# EAGLE design Houston Board v1.1 (EAGLE 9.6.1)
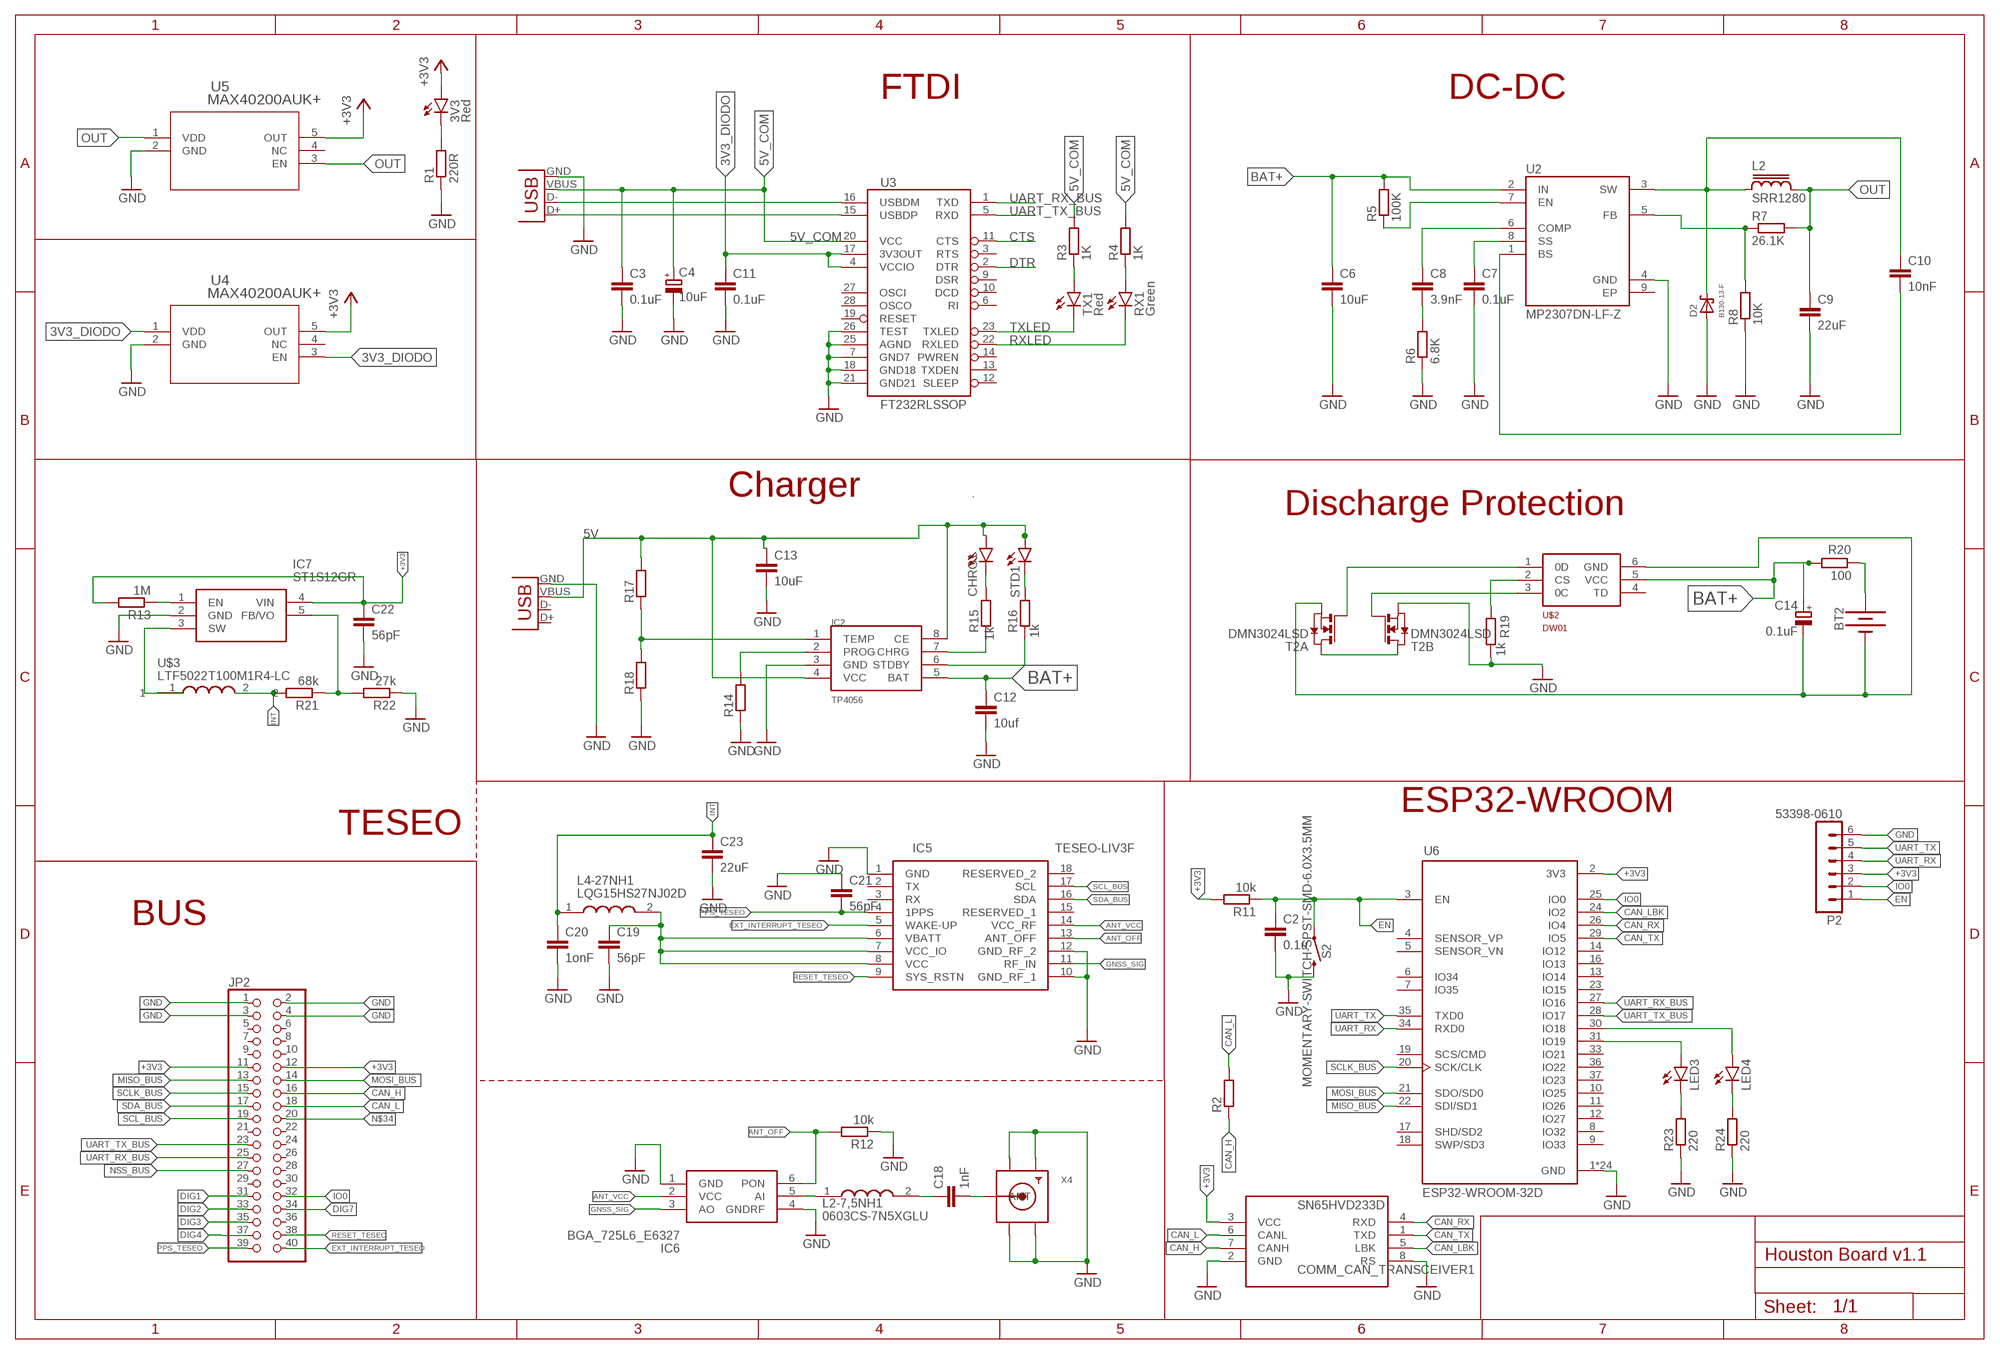
[diagram p0: schematic, sheet 1]

## Parts
3V3  Red  LEDCHIPLED_0805  [CHIPLED_0805]
BT2  BATTERY-18650  [BATTERY_18650-HOLDER]
C2  0.1u  C-EUC1206  [C1206]
C3  0.1uF  C-EUC0805  [C0805]
C4  10uF  CPOL-EUB  [PANASONIC_B]
C6  10uF  C-EUC0805  [C0805]
C7  0.1uF  C-EUC0805  [C0805]
C8  3.9nF  C-EUC0805  [C0805]
C9  22uF  C-EUC0805  [C0805]
C10  10nF  C-EUC0805  [C0805]
C11  0.1uF  C-EUC0805  [C0805]
C12  10uf  C-EUC0805  [C0805]
C13  10uF  C-EUC0805  [C0805]
C14  0.1uF  CPOL-EUC  [PANASONIC_C]
C18  1nF  C-EUC1206  [C1206]
C19  56pF  C-EUC1206  [C1206]
C20  1onF  C-EUC1206  [C1206]
C21  56pF  C-EUC1206  [C1206]
C22  56pF  C-EUC1206  [C1206]
C23  22uF  C-EUC1206  [C1206]
CHRG1  LEDCHIP-LED0805  [CHIP-LED0805]
COMM_CAN_TRANSCEIVER1  SN65HVD233D  [SOIC8]
D2  B130-13-F  [SMA]
IC2  TP4056  [SOP-8]
IC5  TESEO-LIV3F  [SON110P970X1010X230-18N]
IC6  BGA_725L6_E6327  [BGA725L6E6327]
IC7  ST1S12GR  [SOT95P280X110-5N]
JP2  PINHD-2X20  [2X20]
L2  SRR1280  [SRR1280]
L2-7,5NH1  0603CS-7N5XGLU  [0603CS82NXGLW]
L4-27NH1  LQG15HS27NJ02D  [LQG15WH0N7B02D]
LED3  LEDCHIPLED_0805  [CHIPLED_0805]
LED4  LEDCHIPLED_0805  [CHIPLED_0805]
P2  53398-0610  [53398-0610]
R1  220R  R-EU_R0805  [R0805]
R2  R-EU_R0805  [R0805]
R3  1K  R-EU_R0805  [R0805]
R4  1K  R-EU_R0805  [R0805]
R5  100K  R-EU_R0805  [R0805]
R6  6.8K  R-EU_R0805  [R0805]
R7  26.1K  R-EU_R0805  [R0805]
R8  10K  R-EU_R0805  [R0805]
R11  10k  R-EU_R1206  [R1206]
R12  10k  R-EU_M1206  [M1206]
R13  1M  R-EU_M1206  [M1206]
R14  R-EU_R0805  [R0805]
R15  1k  R-EU_R0805  [R0805]
R16  1k  R-EU_R0805  [R0805]
R17  R-EU_R0805  [R0805]
R18  R-EU_R0805  [R0805]
R19  1k  R-EU_R0805  [R0805]
R20  100  R-EU_R0805  [R0805]
R21  68k  R-EU_M1206  [M1206]
R22  27k  R-EU_M1206  [M1206]
R23  220  R-EU_R1206  [R1206]
R24  220  R-EU_R1206  [R1206]
RX1  Green  LEDCHIPLED_0805  [CHIPLED_0805]
S2  MOMENTARY-SWITCH-SPST-SMD-6.0X3.5MM  [TACTILE_SWITCH_SMD_6.0X3.5MM]
STD1  LEDCHIP-LED0805  [CHIP-LED0805]
T2  DMN3024LSD  [TSSOP-8]
TX1  Red  LEDCHIPLED_0805  [CHIPLED_0805]
U2  MP2307DN-LF-Z  [SOIC127P600X170-9N]
U3  FT232RLSSOP  [SSOP28DB]
U4  MAX40200AUK+  [21-0057F_MXM]
U5  MAX40200AUK+  [21-0057F_MXM]
U6  ESP32-WROOM-32D  [MODULE_ESP32-WROOM-32D]
U$2  DW01  [SOT23-6]
U$3  LTF5022T100M1R4-LC  [LTF5022T]
X1  USB-SMD-NS  [USB-MINIB-NOSTOP]
X2  USB-SMD-NS  [USB-MINIB-NOSTOP]
X4  SMACONNECTOR  [SMA90_DIP]

## Nets
3V3_DIODO: C11.1 U3.4(VCCIO) U3.17(3V3OUT) U4.1(VDD) U4.3(EN)
5V: C13.1 CHRG1.A IC2.4(VCC) IC2.8(CE) R17.2 STD1.A X2.VBUS
5V_COM: C3.1 C4.+ R3.2 R4.2 U3.20(VCC) X1.VBUS
+3V3: 3V3.A C22.1 COMM_CAN_TRANSCEIVER1.3(VCC) IC7.4(VIN) JP2.11 JP2.12 P2.3 R11.2 R13.2 U4.5(OUT) U5.5(OUT) U6.2(3V3)
ANT_OFF: IC5.13(ANT_OFF) IC6.6(PON) R12.2
ANT_VCC: IC5.14(VCC_RF) IC6.2(VCC)
BAT+: C6.1 C12.1 C14.+ IC2.5(BAT) R5.2 R20.1 U2.2(IN) U$2.5(VCC)
CAN_H: COMM_CAN_TRANSCEIVER1.7(CANH) JP2.16 R2.1
CAN_L: COMM_CAN_TRANSCEIVER1.6(CANL) JP2.18 R2.2
CAN_LBK: COMM_CAN_TRANSCEIVER1.5(LBK) U6.24(IO2)
CAN_RX: COMM_CAN_TRANSCEIVER1.4(RXD) U6.26(IO4)
CAN_TX: COMM_CAN_TRANSCEIVER1.1(TXD) U6.29(IO5)
CTS: U3.11(CTS)
DTR: U3.2(DTR)
EN: C2.1 P2.1 R11.1 S2.1 U6.3(EN)
EXT_INTERRUPT_TESEO: IC5.5(WAKE-UP) JP2.40
GND: C2.2 C3.2 C4.- C6.2 C7.2 C9.2 C11.2 C12.2 C13.2 C19.2 C20.2 C21.1 C22.2 C23.2 COMM_CAN_TRANSCEIVER1.2(GND) COMM_CAN_TRANSCEIVER1.8(RS) D2.A IC2.3(GND) IC5.1(GND) IC5.10(GND_RF_1) IC5.12(GND_RF_2) IC6.1(GND) IC6.4(GNDRF) IC7.2(GND) JP2.1 JP2.2 JP2.3 JP2.4 P2.6 R1.1 R6.1 R8.1 R12.1 R14.1 R18.1 R19.1 R22.1 R23.1 R24.1 S2.2 T2.6(B:S) T2.7(B:S) U2.4(GND) U3.7(GND7) U3.18(GND18) U3.21(GND21) U3.25(AGND) U3.26(TEST) U4.2(GND) U5.2(GND) U6.1(GND) U6.15(GND) U6.38(GND) U6.39_1(GND) U6.39_2(GND) U6.39_3(GND) U6.39_4(GND) U6.39_5(GND) U6.39_6(GND) U6.39_7(GND) U6.39_8(GND) U6.39_9(GND) U6.39_10(GND) U6.39_11(GND) U6.39_12(GND) U6.39_13(GND) U6.39_14(GND) U6.39_15(GND) U6.39_16(GND) U6.39_17(GND) U6.39_18(GND) U6.39_19(GND) U6.39_20(GND) U6.39_21(GND) X1.GND X2.GND X4.GND1 X4.GND2 X4.GND3 X4.GND4
GNSS_SIG: IC5.11(RF_IN) IC6.3(AO)
INT: C20.1 C23.1 L4-27NH1.1 R21.2 U$3.2
IO0: P2.2 U6.25(IO0)
MISO_BUS: JP2.13 U6.22(SDI/SD1)
MOSI_BUS: JP2.14 U6.21(SDO/SD0)
N$3: JP2.37
N$4: JP2.34
N$7: JP2.32
N$8: R5.1 U2.7(EN)
N$9: C8.2 R6.2
N$10: C7.1 U2.8(SS)
N$11: C8.1 U2.6(COMP)
N$12: C10.1 D2.C L2.1 U2.3(SW)
N$13: R7.1 R8.2 U2.5(FB)
N$14: C10.2 U2.1(BS)
N$16: JP2.35
N$17: JP2.33
N$18: JP2.31
N$19: R3.1 TX1.A
N$20: R4.1 RX1.A
N$21: 3V3.C R1.2
N$22: LED3.C R23.2
N$23: LED4.C R24.2
N$24: LED4.A U6.30(IO18)
N$25: LED3.A U6.31(IO19)
N$28: C19.1 IC5.6(VBATT) IC5.7(VCC_IO) IC5.8(VCC) L4-27NH1.2
N$29: C18.2 X4.ANTENNA(ANT)
N$30: IC6.5(AI) L2-7,5NH1.1
N$31: IC2.2(PROG) R14.2
N$32: IC2.7(CHRG) R15.1
N$33: IC2.6(STDBY) R16.1
N$34: JP2.20
N$35: CHRG1.C R15.2
N$36: R16.2 STD1.C
N$37: IC2.1(TEMP) R17.1 R18.2
N$38: R19.2 U$2.2(CS)
N$39: BT2.PWR@1(+) R20.2
N$40: BT2.GND@1(-) C14.- T2.2(A:S) T2.3(A:S) U$2.6(GND)
N$41: T2.1(A:D) T2.8(B:D)
N$42: T2.4(A:G) U$2.1(0D)
N$43: T2.5(B:G) U$2.3(0C)
N$44: C18.1 L2-7,5NH1.2
N$45: IC7.1(EN) R13.1
N$46: IC7.3(SW) U$3.1
N$47: IC7.5(FB/VO) R21.1 R22.2
NSS_BUS: JP2.27
OUT: C9.1 L2.2 R7.2 U5.1(VDD) U5.3(EN)
PPS_TESEO: C21.2 IC5.4(1PPS) JP2.39
RESET_TESEO: IC5.9(SYS_RSTN) JP2.38
RXLED: RX1.C U3.22(RXLED)
SCL_BUS: IC5.17(SCL) JP2.19
SCLK_BUS: JP2.15 U6.20(SCK/CLK)
SDA_BUS: IC5.16(SDA) JP2.17
TXLED: TX1.C U3.23(TXLED)
UART_RX: P2.4 U6.34(RXD0)
UART_RX_BUS: JP2.25 U3.1(TXD) U6.27(IO16)
UART_TX: P2.5 U6.35(TXD0)
UART_TX_BUS: JP2.23 U3.5(RXD) U6.28(IO17)
USB_D+1: U3.15(USBDP) X1.D+
USB_D-1: U3.16(USBDM) X1.D-
Unconnected: IC5.2(TX) IC5.3(RX) IC5.15(RESERVED_1) IC5.18(RESERVED_2) JP2.5 JP2.6 JP2.7 JP2.8 JP2.9 JP2.10 JP2.21 JP2.22 JP2.24 JP2.26 JP2.28 JP2.29 JP2.30 JP2.36 U3.3(RTS) U3.6(RI) U3.9(DSR) U3.10(DCD) U3.12(SLEEP) U3.13(TXDEN) U3.14(PWREN) U3.19(RESET) U3.27(OSCI) U3.28(OSCO) U4.4(NC) U5.4(NC) U6.4(SENSOR_VP) U6.5(SENSOR_VN) U6.6(IO34) U6.7(IO35) U6.8(IO32) U6.9(IO33) U6.10(IO25) U6.11(IO26) U6.12(IO27) U6.13(IO14) U6.14(IO12) U6.16(IO13) U6.17(SHD/SD2) U6.18(SWP/SD3) U6.19(SCS/CMD) U6.23(IO15) U6.33(IO21) U6.36(IO22) U6.37(IO23) U$2.4(TD) X2.D+ X2.D-

## Notes on the sheet
- FTDI | DC-DC
- Charger
- Discharge Protection
- ESP32-WROOM
- TESEO
- BUS

## Power pins joined to a net without a drawn wire
EP: U2.9(EP)

## Library data of the parts
3V3 CHRG1 LED3 LED4 RX1 STD1 TX1 = led:LED: LED OSRAM: - CHIPLED LG R971, LG N971, LY N971, LG Q971, LY Q971, LO R971, LY R971 LH N974, LH R974 LS Q976, LO Q976, LY Q976 LO Q996 - Hyper CHIPLED LW Q18S LB Q993, LB Q99A, LB R99A - SideLED LS A670, LO A670, LY A670, LG A670, LP A670 LB A673, LV A673, LT A673, LW A673 LH A674 LY A675 LS A676, LA A676, LO A676, LY A676, LW A676 LS A679, LY A679, LG A679 - Hyper Micro SIDELED® LS Y876, LA Y876, LO Y876, LY Y876 LT Y87S - SmartLED LW L88C, LW L88S LB L89C, LB L89S, LG L890 LS L89K, LO L89K, LY L89K LS L896, LA L896, LO L896, LY L896 - TOPLED LS T670, LO T670, LY T670, LG T670, LP T670 LSG T670, LSP T670, LSY T670, LOP T670, LYG T670 LG T671, LOG T671, LSG T671 LB T673, LV T673, LT T673, LW T673 LH T674 LS T676, LA T676, LO T676, LY T676, LB T676, LH T676, LSB T676, LW T676 LB T67C, LV T67C, LT T67C, LS T67K, LO T67K, LY T67K, LW E67C LS E67B, LA E67B, LO E67B, LY E67B, LB E67C, LV E67C, LT E67C LW T67C LS T679, LY T679, LG T679 LS T770, LO T770, LY T770, LG T770, LP T770 LB T773, LV T773, LT T773, LW T773 LH T774 LS E675, LA E675, LY E675, LS T675 LS T776, LA T776, LO T776, LY T776, LB T776 LHGB T686 LT T68C, LB T68C - Hyper Mini TOPLED® LB M676 - Mini TOPLED Santana® LG M470 LS M47K, LO M47K, LY M47K Source: http://www.osram.convergy.de LUXEON: - LUMILED® LXK2-PW12-R00, LXK2-PW12-S00, LXK2-PW14-U00, LXK2-PW14-V00 LXK2-PM12-R00, LXK2-PM12-S00, LXK2-PM14-U00 LXK2-PE12-Q00, LXK2-PE12-R00, LXK2-PE12-S00, LXK2-PE14-T00, LXK2-PE14-U00 LXK2-PB12-K00, LXK2-PB12-L00, LXK2-PB12-M00, LXK2-PB14-N00, LXK2-PB14-P00, LXK2-PB14-Q00 LXK2-PR12-L00, LXK2-PR12-M00, LXK2-PR14-Q00, LXK2-PR14-R00 LXK2-PD12-Q00, LXK2-PD12-R00, LXK2-PD12-S00 LXK2-PH12-R00, LXK2-PH12-S00 LXK2-PL12-P00, LXK2-PL12-Q00, LXK2-PL12-R00 Source: www.luxeon.com KINGBRIGHT: KA-3528ASYC Source: www.kingbright.com
BT2 = SparkFun-Batteries:BATTERY: Battery - Single Cell A variety of battery chemistries, sizes, and footprints. Device List: 20MM_PTH - Coin Cell Battery Holder - 20mm (PTH) <https://www.sparkfun.com/products/783> 6.8MM_PTH - Coin Cell Battery Holder - 6.8MM(SMD) <https://www.digikey.com/product-detail/en/seiko-instruments/MS621FE-FL11E/728-1057-ND/1889208?WT.srch=1&gclid=CNOQ5a6LzdQCFZS2wAodXCkE0g> 12MM_SMD - Coin Cell Battery Holder - 12mm (SMD) <https://www.sparkfun.com/products/10592> 12MM_PTH - Coin Cell Battery Holder - 12mm (PTH) <https://www.sparkfun.com/products/7948> 20MM_SMD - 20mm Coin Cell Battery Holder (SMD) (2 legs) Used on the Big Time Watch Kit <https://www.sparkfun.com/products/11734> 20MM_SMD_4LEGS - Coin Cell Battery Holder - 20mm (SMD) <https://www.sparkfun.com/products/11892> 20MM_SMD_4LEGS_OVERPASTE - Coin Cell Battery Holder - 20mm (SMD) <https://www.sparkfun.com/products/11892> (Over-paste on the legs) 24.5MM_PTH - Coin Cell Battery Holder - 24.5mm (PTH) <https://www.sparkfun.com/products/8863> 9V - 9V Battery Holder - PC Mount Used on the SparkFun SparkPunk Sound Kit <https://www.sparkfun.com/products/11177> and SparkFun SparkPunk Sequencer Kit <https://www.sparkfun.com/products/12707> 18650 - Battery Holder - 18650 (PTH) <https://www.sparkfun.com/products/13113> AA - Battery Holder - 1xAA (PTH) <https://www.sparkfun.com/products/7949> AAA - Battery Holder - 1xAAA (PTH) <https://www.sparkfun.com/products/12718> AA_KIT - Battery Holder - 1xAA (PTH) <https://www.sparkfun.com/products/7949> Special kit package - pads only have exposed copper on one side of the board. AAA_KIT - Battery Holder - 1xAAA (PTH) <https://www.sparkfun.com/products/12718> Special kit package - pads only have exposed copper on one side of the board.; PROD_ID: BATT-12327; SF_SKU: PRT-13113
C2 C3 C6-C13 C18-C23 = rcl:C-EU: CAPACITOR, European symbol; SPICEPREFIX: C
C4 C14 = rcl:CPOL-EU: POLARIZED CAPACITOR, European symbol; SPICEPREFIX: C
COMM_CAN_TRANSCEIVER1 = SN65HVD233D:SN65HVD233D; AVAILABILITY: Unavailable; DESCRIPTION: 3.3V CAN Transceiver with Standby Mode, Loop-back 8-SOIC -40 to 125; MF: Texas Instruments; MP: SN65HVD233D; PACKAGE: SOIC-8 Texas Instruments; PRICE: None
D2 = B130-13-F:B130-13-F; AVAILABILITY: Unavailable; DESCRIPTION: Diode Schottky 30V 1A Surface Mount SMA; MF: Multicomp; MP: B130-13-F; PACKAGE: DO-214 Multicomp; PRICE: None
IC2 = TP4056:TP4056
IC5 = SamacSys_Parts:TESEO-LIV3F: GPS Modules Tiny GNSS module Source: Datasheet <https://www.st.com/resource/en/datasheet/teseo-liv3f.pdf>; ARROW_PART_NUMBER: TESEO-LIV3F; ARROW_PRICE-STOCK: https://www.arrow.com/en/products/teseo-liv3f/stmicroelectronics; DESCRIPTION: GPS Modules Tiny GNSS module; HEIGHT: 2.3mm; MANUFACTURER_NAME: STMicroelectronics; MANUFACTURER_PART_NUMBER: TESEO-LIV3F; MOUSER_PART_NUMBER: 511-TESEO-LIV3F; MOUSER_PRICE-STOCK: https://www.mouser.co.uk/ProductDetail/STMicroelectronics/TESEO-LIV3F?qs=HXFqYaX1Q2wXp9tn7dEmMw%3D%3D
IC6 = SamacSys_Parts:BGA_725L6_E6327: INFINEON - BGA 725L6 E6327 - RF AMP, 20DB, 1.615GHZ, 3.6V, TSLP-6 Source: Datasheet <https://www.infineon.com/dgdl/Infineon-BGA725L6-DS-v02_00-en.pdf?fileId=db3a30433784a0400137ef9a4d341f23>; DESCRIPTION: INFINEON - BGA 725L6 E6327 - RF AMP, 20DB, 1.615GHZ, 3.6V, TSLP-6; HEIGHT: 0.4mm; MANUFACTURER_NAME: Infineon; MANUFACTURER_PART_NUMBER: BGA 725L6 E6327; MOUSER_PART_NUMBER: 726-BGA725L6E6327; MOUSER_PRICE-STOCK: https://www.mouser.co.uk/ProductDetail/Infineon-Technologies/BGA-725L6-E6327?qs=l6ZoeTYLMwPIme2fOcdDvg%3D%3D
IC7 = SamacSys_Parts:ST1S12GR: STMICROELECTRONICS - ST1S12GR - DC/DC CONV, BUCK, 1.7MHZ, TSOT-23-5 Source: Datasheet <https://www.st.com/resource/en/datasheet/st1s12xx.pdf>; ARROW_PART_NUMBER: ST1S12GR; ARROW_PRICE-STOCK: https://www.arrow.com/en/products/st1s12gr/stmicroelectronics; DESCRIPTION: STMICROELECTRONICS - ST1S12GR - DC/DC CONV, BUCK, 1.7MHZ, TSOT-23-5; HEIGHT: 1.1mm; MANUFACTURER_NAME: STMicroelectronics; MANUFACTURER_PART_NUMBER: ST1S12GR; MOUSER_PART_NUMBER: 511-ST1S12GR; MOUSER_PRICE-STOCK: https://www.mouser.co.uk/ProductDetail/STMicroelectronics/ST1S12GR?qs=QKF3unAkNR%252BifYUR85%252B%252BAA%3D%3D
JP2 = pinhead:PINHD-2X20: PIN HEADER
L2 = inductor-bourns:SRR1280: POWER INDUCTOR
L2-7,5NH1 = SamacSys_Parts:0603CS-7N5XGLU: COILCRAFT - 0603CS-7N5XGLU - High Frequency Inductor, 7.5 nH, 0603CS Series, 700 mA, 0603 [1608 Metric], Wirewound, 0.106 ohm Source: Datasheet <https://www.coilcraft.com/pdfs/0603cs.pdf>; DESCRIPTION: COILCRAFT - 0603CS-7N5XGLU - High Frequency Inductor, 7.5 nH, 0603CS Series, 700 mA, 0603 [1608 Metric], Wirewound, 0.106 ohm; HEIGHT: 1mm; MANUFACTURER_NAME: COILCRAFT; MANUFACTURER_PART_NUMBER: 0603CS-7N5XGLU
L4-27NH1 = SamacSys_Parts:LQG15HS27NJ02D: Inductor SMD 0402 27nH 300mA Murata LQG15HS Series Wire-wound SMD Inductor 27 nH +/-5% Wire-Wound 300mA Idc Q:8 Source: Datasheet <https://psearch.en.murata.com/inductor/product/LQG15HS27NJ02#.html>; DESCRIPTION: Inductor SMD 0402 27nH 300mA Murata LQG15HS Series Wire-wound SMD Inductor 27 nH +/-5% Wire-Wound 300mA Idc Q:8; HEIGHT: 0.55mm; MANUFACTURER_NAME: Murata Electronics; MANUFACTURER_PART_NUMBER: LQG15HS27NJ02D; MOUSER_PART_NUMBER: 81-LQG15HS27NJ02D; MOUSER_PRICE-STOCK: https://www.mouser.co.uk/ProductDetail/Murata-Electronics/LQG15HS27NJ02D?qs=ctz47l0uL1AbPpSO0oLF1A%3D%3D
P2 = con-molex-picoblade:53398-0610: HEADER
R1-R8 R11 R14-R20 R23 R24 = rcl:R-EU_: RESISTOR, European symbol; SPICEPREFIX: R
R12 R13 R21 R22 = rcl (2):R-EU_: RESISTOR, European symbol
S2 = SparkFun-Switches:MOMENTARY-SWITCH-SPST: Momentary Switch (Pushbutton) - SPST Normally-open (NO) SPST momentary switches (buttons, pushbuttons). Variants PTH-12MM - 12mm square, through-hole Momentary Pushbutton Switch - 12mm Square <https://www.sparkfun.com/products/9190> (COM-09190) PTH-6.0MM, PTH-6.0MM-KIT - 6.0mm square, through-hole Mini Pushbutton Switch <https://www.sparkfun.com/products/97> (COM-00097) KIT package intended for soldering kit's - only one side of pads' copper is exposed. PTH-RIGHT-ANGLE-KIT - Right-angle, through-hole Right Angle Tactile Button <https://www.sparkfun.com/products/10791> - Used on SparkFun BigTime Watch Kit <https://www.sparkfun.com/products/11734> SMD-12MM - 12mm square, surface-mount Tactile Button - SMD (12mm) <https://www.sparkfun.com/products/12993> (COM-12993) Used on SparkFun PicoBoard <https://www.sparkfun.com/products/11888> SMD-4.5MM - 4.5mm Square Trackball Switch Used on SparkFun Blackberry Trackballer Breakout <https://www.sparkfun.com/products/13169> SMD-4.6MMX2.8MM - 4.60mm x 2.80mm, surface mount Used on SparkFun SAMD21 Mini Breakout <https://www.sparkfun.com/products/13664> SMD-5.2MM, SMD-5.2-REDUNDANT - 5.2mm square, surface-mount Mini Pushbutton Switch - SMD <https://www.sparkfun.com/products/8720> (COM-08720) Used on Arduino Pro Mini <https://www.sparkfun.com/products/11114> REDUNDANT package connects both switch circuits together SMD-6.0X3.5MM - 6.0 x 3.5mm, surface mount Momentary Reset Switch SMD <https://www.sparkfun.com/products/8229> (COM-08229) SMD-6.2MM-TALL - 6.2mm square, surface mount Tactile Button - SMD (6mm) <https://www.sparkfun.com/products/12992> Used on SparkFun Digital Sandbox <https://www.sparkfun.com/products/12651> SMD-RIGHT-ANGLE - Right-angle, surface mount Used on SparkFun Block for Intel® Edison - Arduino <https://www.sparkfun.com/products/13036>; PROD_ID: SWCH-14278; SF_SKU: COM-08229
T2 = FS8205A:DMN3024LSD: DUAL N-CHANNEL ENHANCEMENT MODE MOSFET data sheet <http://goo.gl/dRgboR> Dave.Calaway Eagle Library <https://goo.gl/Muy1Tr>
U2 = MP2307DN-LF-Z:MP2307DN-LF-Z: MP2307 Series 23 V 3 A 380 KHz Synchronous Rectified Step-Down Converter-SOIC-8; AVAILABILITY: Unavailable; DESCRIPTION: Buck Switching Regulator IC Positive Adjustable 0.925V 1 Output 3A 8-SOIC _0.154, 3.90mm Width_ Exposed Pad; MF: Monolithic Power; MP: MP2307DN-LF-Z; PACKAGE: SOIC-8 Monolithic Power; PRICE: None
U3 = SparkFun:FT232RL: USB UART FT232RL 4th Generation USB UART (USB <-> Serial) Controller. Spark Fun Electronics SKU : COM-00650
U4 U5 = MAX40200:MAX40200AUK+; BUILT_BY: EMA_UL_Team; COPYRIGHT: Copyright (C) 2018 Accelerated Designs. All rights reserved; MANUFACTURER_PART_NUMBER: MAX40200AUK+; SOURCELIBRARY: Maxim_2018-11-30; VENDOR: Maxim Integrated Products
U6 = ESP32-WROOM-32D:ESP32-WROOM-32D: Bluetooth, WiFi 802.11b/g/n, Bluetooth v4.2 + EDR, Class 1, 2 and 3 Transceiver Module 2.4GHz ~ 2.5GHz Integrated, Trace Surface Mount; AVAILABILITY: Unavailable; DESCRIPTION: Bluetooth, WiFi 802.11b/g/n, Bluetooth v4.2 +EDR, Class 1, 2 and 3 Transceiver Module 2.4GHz ~ 2.5GHz Integrated, Trace Surface Mount; MF: Espressif Systems; MP: ESP32-WROOM-32D; PACKAGE: Module Espressif Systems; PRICE: None
U$2 = DW01:DW01: The DW01-P battery protection IC is designed to protect lithium-ion/polymer battery from damage or degrading the lifetime due to overcharge, overdischarge, and/or overcurrent for one-cell lithium-ion/polymer battery powered systems, such as cellular phones. Data sheet <http://goo.gl/4y108d> Dave.Calaway Eagle Library <https://goo.gl/Muy1Tr>
U$3 = mylbr:LTF5022T: Inductor, 10uH
X1 X2 = SparkFun:USB: USB Connectors USB-B-PTH is fully proven SKU : PRT-00139 USB-miniB is fully proven SKU : PRT-00587 USB-A-PCB is untested. USB-A-H is throughly reviewed, but untested. Spark Fun Electronics SKU : PRT-00437 USB-B-SMT is throughly reviewed, but untested. Needs silkscreen touching up. USB-A-S has not been used/tested USB-MB-H has not been used/tested
X4 = adafruit:SMACONNECTOR: SMA Connector 90° DIP SMA Connector, 50 Ohm (4UConnector: 07259); SPICEPREFIX: X

## Net classes
1 power: width 0.254 mm

## Board
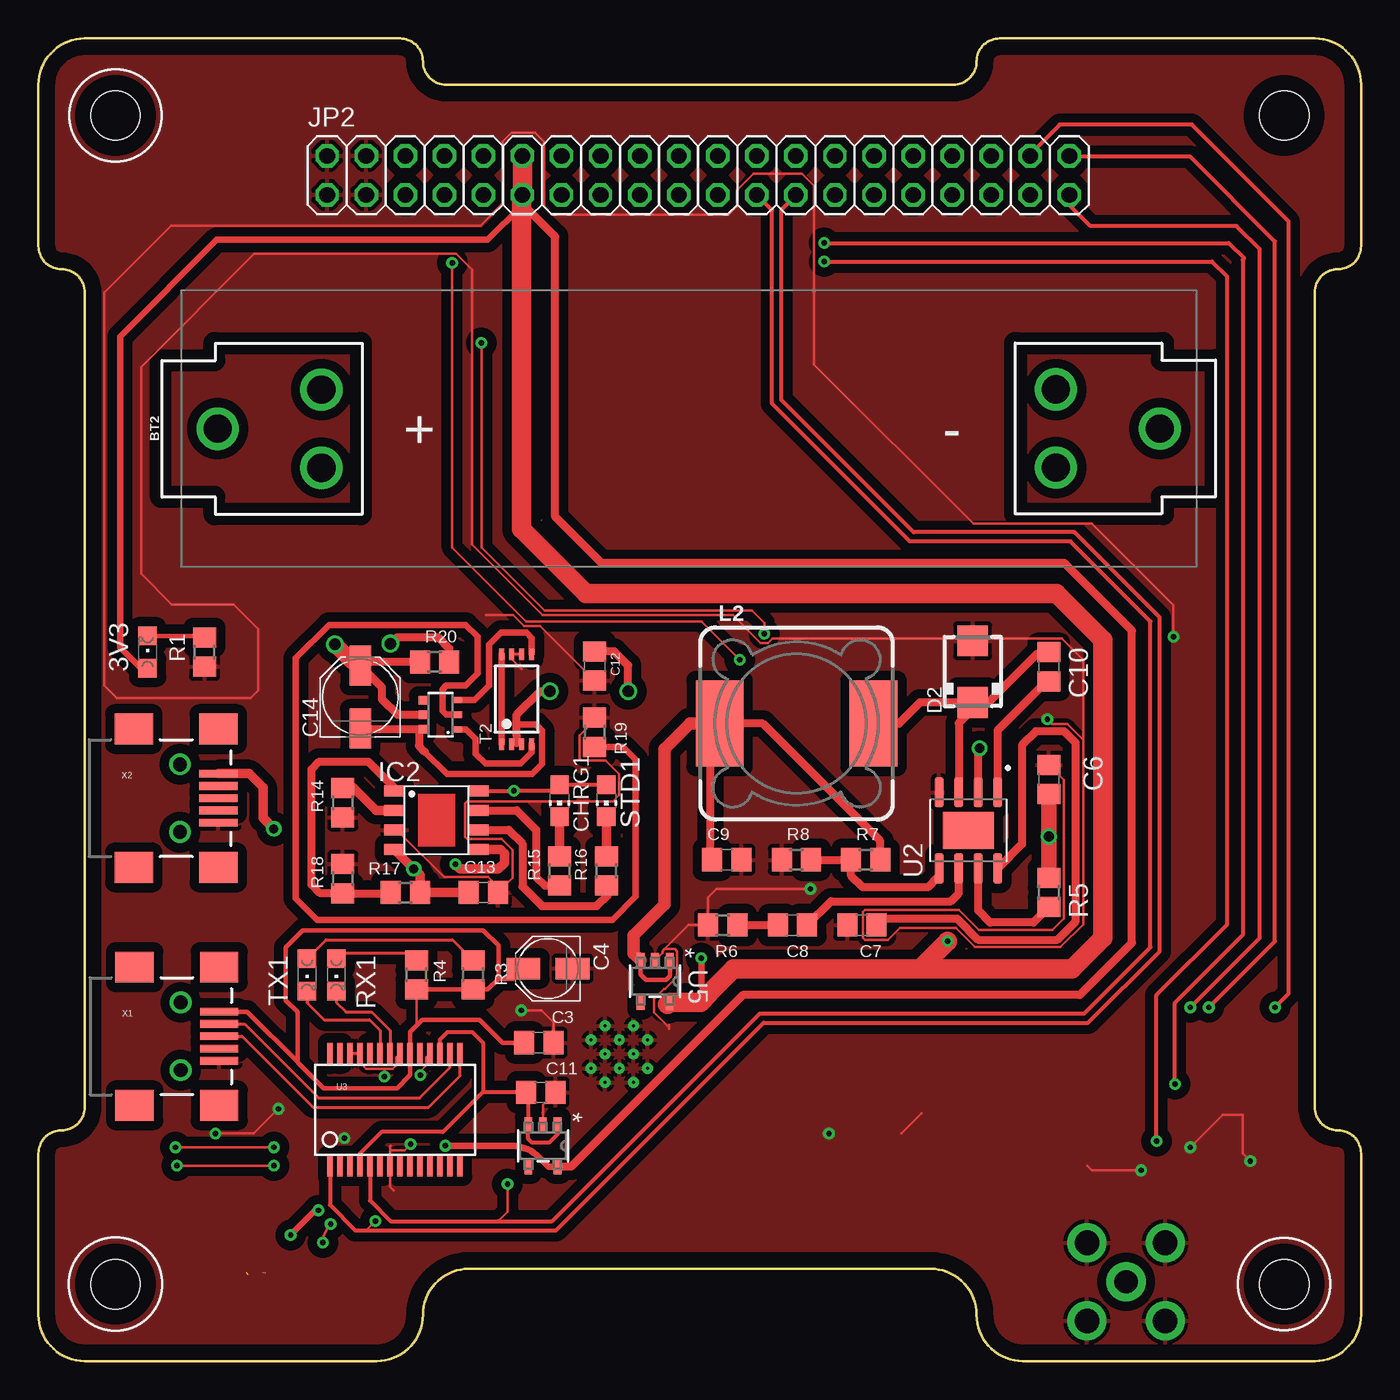
[diagram p1: board, top side]
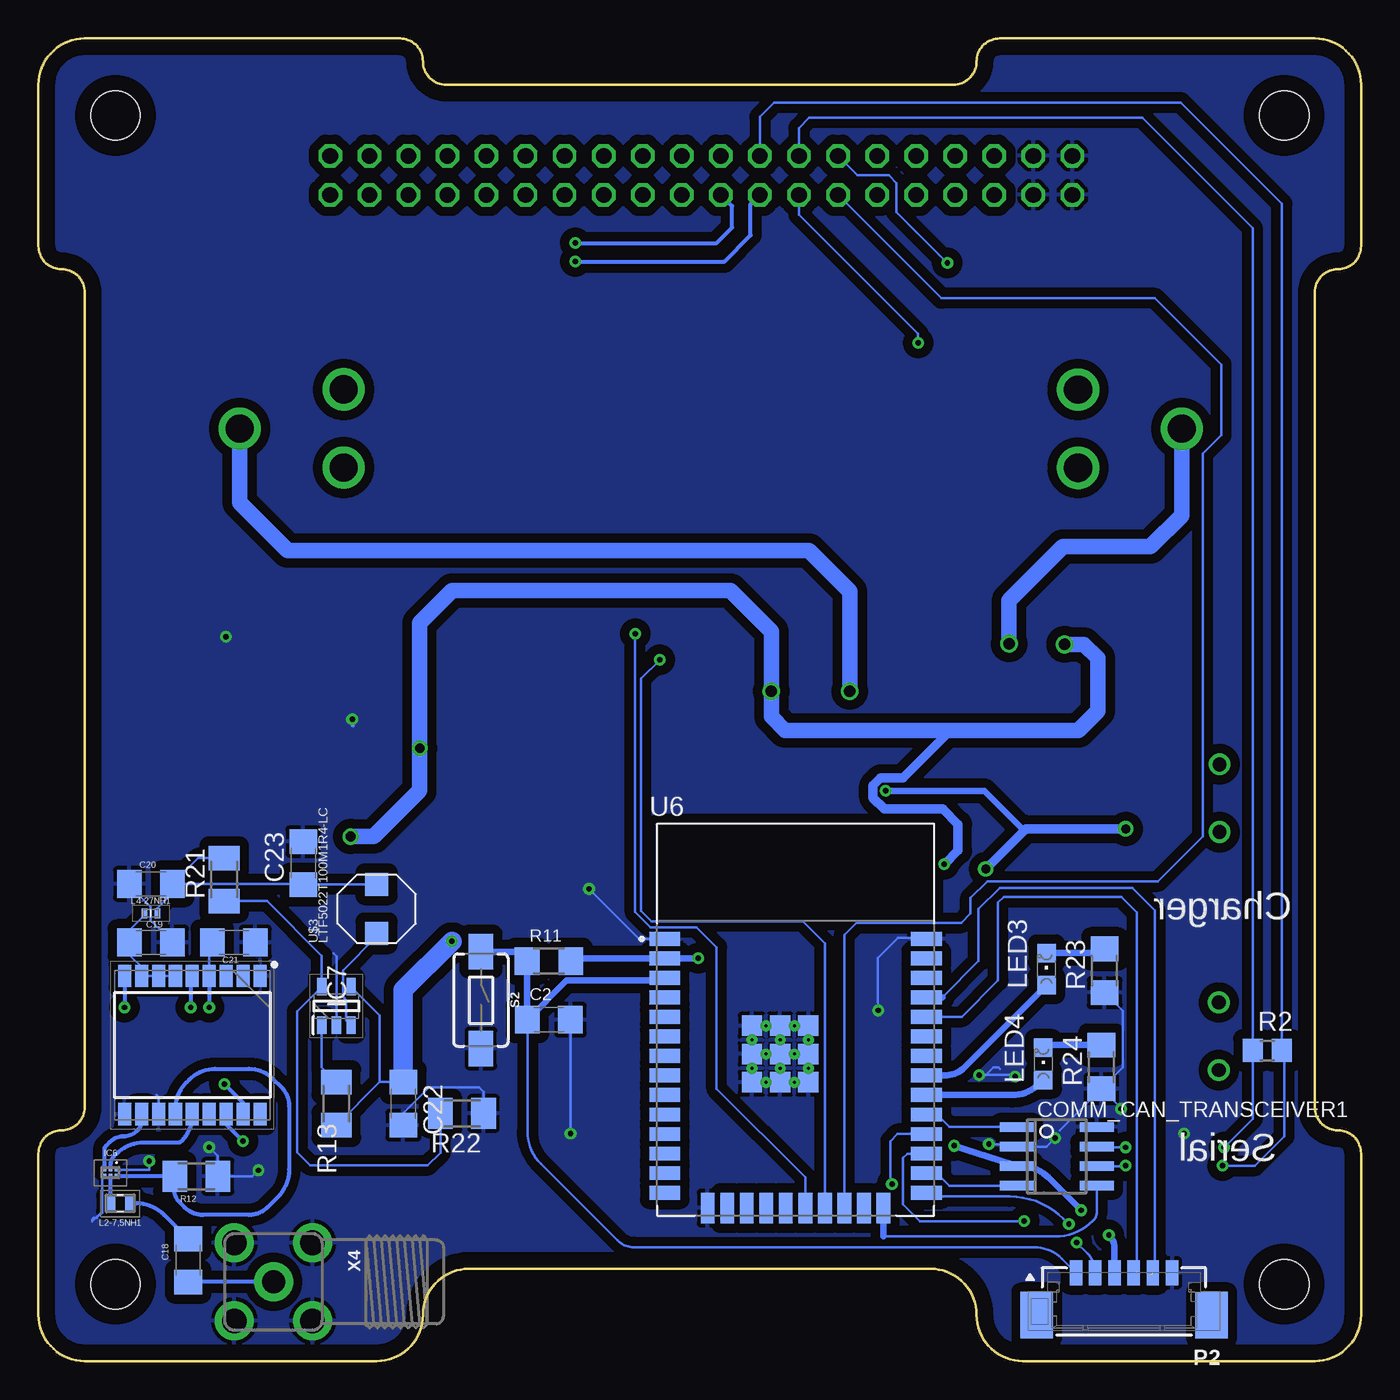
[diagram p2: board, bottom side, seen from below]

Size 86 x 86 mm. Coordinates in mm from the lower left corner, seen from the top.
Outline: 0,83 0,72.5 arc90 1.5,71 arc-90 3,69.5 3,16.5 arc-90 1.5,15 arc90 0,13.5 0,3 arc90 3,0 22,0 arc90 25,3 arc-90 28,6 58,6 arc-90 61,3 arc90 64,0 83,0 arc90 86,3 86,13.5 arc90 84.5,15 arc-90 83,16.5 83,69.5 arc-90 84.5,71 arc90 86,72.5 86,83 arc90 83,86 62.5,86 arc90 61,84.5 arc-90 59.5,83 26.5,83 arc-90 25,84.5 arc90 23.5,86 3,86 arc90 0,83
Copper layers (1*16): Top 0.035mm / dielectric 1.5mm / Bottom 0.035mm
Design rules "default": minimum track width 6mil, minimum drill 0.35mm, track to track 6mil, track to pad 6mil, pad to pad 6mil, via to via 6mil, smd to smd 6mil, copper to edge 40mil, drill to drill 6mil, minimum pad ring 10mil, minimum via ring 8mil, stop-mask expansion 4mil, vias tented up to drill 0mil, thermal gap 10mil
Holes 3.2 mm at 5,5 81,5 81,81 5,81

### Footprints (pad centres in the part's own frame; a part is rotated, then mirrored left to right if it is on the bottom)
CHIPLED_0805 = smd 1.2 x 1.2: A 0,-1.05; C 0,1.05
BATTERY_18650-HOLDER = drill 1.829: GND@1 30.628,0.01; GND@2 23.88,2.55; GND@3 23.88,-2.53; PWR@1 -30.628,-0.01; PWR@2 -23.88,2.53; PWR@3 -23.88,-2.55
C1206 = smd 1.6 x 1.8: 1 -1.4,0; 2 1.4,0
C0805 = smd 1.3 x 1.5: 1 -0.95,0; 2 0.95,0
PANASONIC_B = smd 2.2 x 1.4: + 1.6,0; - -1.6,0
PANASONIC_C = smd 2.6 x 1.4: + 2.05,0; - -2.05,0
CHIP-LED0805 = smd 1.2 x 1.2: A 0,-1.05; C 0,1.05
SOIC8 = smd 0.6 x 2.2: 1 -1.905,-2.6; 2 -0.635,-2.6; 3 0.635,-2.6; 4 1.905,-2.6; 5 1.905,2.6; 6 0.635,2.6; 7 -0.635,2.6; 8 -1.905,2.6
SMA = smd 2 x 2: A 2,0; C -2,0
SOP-8 = smd 1.3 x 0.7: 1 -2.75,1.905; 2 -2.75,0.635; 3 -2.75,-0.635; 4 -2.75,-1.905; 5 2.75,-1.905; 6 2.75,-0.635; 7 2.75,0.635; 8 2.75,1.905
SON110P970X1010X230-18N = smd 1.45 x 0.85: 1 -4.5,4.4; 2 -4.5,3.3; 3 -4.5,2.2; 4 -4.5,1.1; 5 -4.5,0; 6 -4.5,-1.1; 7 -4.5,-2.2; 8 -4.5,-3.3; 9 -4.5,-4.4; 10 4.5,-4.4; 11 4.5,-3.3; 12 4.5,-2.2; 13 4.5,-1.1; 14 4.5,0; 15 4.5,1.1; 16 4.5,2.2; 17 4.5,3.3; 18 4.5,4.4
BGA725L6E6327 = smd 0.25 x 0.25: 1 0.4,0.2; 2 0,0.2; 3 -0.4,0.2; 4 -0.4,-0.2; 5 0,-0.2; 6 0.4,-0.2
SOT95P280X110-5N = smd 1.15 x 0.6: 1 -1.25,0.95; 2 -1.25,0; 3 -1.25,-0.95; 4 1.25,-0.95; 5 1.25,0.95
2X20 = drill 1.016 octagon: 1 -24.13,-1.27; 2 -24.13,1.27; 3 -21.59,-1.27; 4 -21.59,1.27; 5 -19.05,-1.27; 6 -19.05,1.27; 7 -16.51,-1.27; 8 -16.51,1.27; 9 -13.97,-1.27; 10 -13.97,1.27; 11 -11.43,-1.27; 12 -11.43,1.27; 13 -8.89,-1.27; 14 -8.89,1.27; 15 -6.35,-1.27; 16 -6.35,1.27; 17 -3.81,-1.27; 18 -3.81,1.27; 19 -1.27,-1.27; 20 -1.27,1.27; 21 1.27,-1.27; 22 1.27,1.27; 23 3.81,-1.27; 24 3.81,1.27; 25 6.35,-1.27; 26 6.35,1.27; 27 8.89,-1.27; 28 8.89,1.27; 29 11.43,-1.27; 30 11.43,1.27; 31 13.97,-1.27; 32 13.97,1.27; 33 16.51,-1.27; 34 16.51,1.27; 35 19.05,-1.27; 36 19.05,1.27; 37 21.59,-1.27; 38 21.59,1.27; 39 24.13,-1.27; 40 24.13,1.27
SRR1280 = smd 5.6 x 3.1: 1 0.635,5; 2 0.635,-5
0603CS82NXGLW = smd 1.02 x 0.64: 1 0,0.64; 2 0,-0.64
LQG15WH0N7B02D = smd 0.35 x 0.65: 1 -0.425,0; 2 0.425,0
53398-0610 = smd 0.8 x 1.6: 1 3.125,0; 2 1.875,0; 3 0.625,0; 4 -0.625,0; 5 -1.875,0; 6 -3.125,0 | smd 2.1 x 3: M1 5.685,2.75; M2 -5.685,2.75
R0805 = smd 1.3 x 1.5: 1 -0.95,0; 2 0.95,0
R1206 = smd 1.6 x 1.803: 1 -1.422,0; 2 1.422,0
M1206 = smd 1.6 x 2: 1 -1.4,0; 2 1.4,0
TACTILE_SWITCH_SMD_6.0X3.5MM = smd 2.3 x 1.6: 1 -3.15,0; 2 3.15,0
TSSOP-8 = smd 0.3 x 0.75: 1 -0.975,-2.925; 2 -0.325,-2.925; 3 0.325,-2.925; 4 0.975,-2.925; 5 0.975,2.925; 6 0.325,2.925; 7 -0.325,2.925; 8 -0.975,2.925
SOIC127P600X170-9N = smd 1.97 x 0.6: 1 -2.475,1.905; 2 -2.475,0.635; 3 -2.475,-0.635; 4 -2.475,-1.905; 5 2.475,-1.905; 6 2.475,-0.635; 7 2.475,0.635; 8 2.475,1.905 | smd 2.41 x 3.3: 9 0,0
SSOP28DB = smd 0.348 x 1.397: 1 -4.225,-3.656; 2 -3.575,-3.656; 3 -2.925,-3.656; 4 -2.275,-3.656; 5 -1.625,-3.656; 6 -0.975,-3.656; 7 -0.325,-3.656; 8 0.325,-3.656; 9 0.975,-3.656; 10 1.625,-3.656; 11 2.275,-3.656; 12 2.925,-3.656; 13 3.575,-3.656; 14 4.225,-3.656; 15 4.225,3.656; 16 3.575,3.656; 17 2.925,3.656; 18 2.275,3.656; 19 1.625,3.656; 20 0.975,3.656; 21 0.325,3.656; 22 -0.325,3.656; 23 -0.975,3.656; 24 -1.625,3.656; 25 -2.275,3.656; 26 -2.925,3.656; 27 -3.575,3.656; 28 -4.225,3.656
21-0057F_MXM = smd 0.978 x 0.508: 1 -1.365,0.95; 2 -1.365,0; 3 -1.365,-0.95; 4 1.365,-0.95; 5 1.365,0.95
MODULE_ESP32-WROOM-32D = smd 2 x 0.9: 1 -8.5,5.26; 2 -8.5,3.99; 3 -8.5,2.72; 4 -8.5,1.45; 5 -8.5,0.18; 6 -8.5,-1.09; 7 -8.5,-2.36; 8 -8.5,-3.63; 9 -8.5,-4.9; 10 -8.5,-6.17; 11 -8.5,-7.44; 12 -8.5,-8.71; 13 -8.5,-9.98; 14 -8.5,-11.25; 25 8.5,-11.25; 26 8.5,-9.98; 27 8.5,-8.71; 28 8.5,-7.44; 29 8.5,-6.17; 30 8.5,-4.9; 31 8.5,-3.63; 32 8.5,-2.36; 33 8.5,-1.09; 34 8.5,0.18; 35 8.5,1.45; 36 8.5,2.72; 37 8.5,3.99; 38 8.5,5.26 | smd 0.9 x 2: 15 -5.715,-12.25; 16 -4.445,-12.25; 17 -3.175,-12.25; 18 -1.905,-12.25; 19 -0.635,-12.25; 20 0.635,-12.25; 21 1.905,-12.25; 22 3.175,-12.25; 23 4.445,-12.25; 24 5.715,-12.25 | smd 1.33 x 1.33: 39_1 -2.835,-0.405; 39_2 -1,-0.405; 39_3 0.835,-0.405; 39_4 -2.835,-2.24; 39_5 -1,-2.24; 39_6 0.835,-2.24; 39_7 -2.835,-4.075; 39_8 -1,-4.075; 39_9 0.835,-4.075 | drill 0.2 pad 0.3: 39_10 -1.917,-0.405; 39_11 -0.083,-0.405; 39_12 -2.835,-1.323; 39_13 -1,-1.323; 39_14 0.835,-1.323; 39_15 -1.917,-2.24; 39_16 -0.083,-2.24; 39_17 -2.835,-3.158; 39_18 -1,-3.158; 39_19 0.835,-3.158; 39_20 -1.917,-4.075; 39_21 -0.083,-4.075
SOT23-6 = smd 0.4 x 0.55: 1 -0.95,-1.15; 2 0,-1.15; 3 0.95,-1.15 | smd 0.55 x 0.55: 4 0.95,1.15; 5 0,1.15; 6 -0.95,1.15
LTF5022T = smd 1.5 x 1.5: 1 0,0; 2 3.175,0
USB-MINIB-NOSTOP = smd 2.5 x 0.5: D+ 2.5,0; D- 2.5,0.8; GND 2.5,-1.6; ID 2.5,-0.8; VBUS 2.5,1.6 | smd 2.5 x 2: G1 -3,-4.5; G2 -3,4.5; G3 2.5,4.5; G4 2.5,-4.5 | drill 0.9 pad 0.8: H1 0,2.2 | drill 0.9 pad 0.787: H2 0,-2.2
SMA90_DIP = drill 1.5 pad 2.54: ANTENNA 0,0 | drill 1.6 pad 2.54: GND1 -2.54,2.54; GND2 2.54,2.54; GND3 -2.54,-2.54; GND4 2.54,-2.54

### Placement (x,y rotation side)
3V3  7.1,46.1 0 top
BT2  42.28,60.63 0 top
C2  52.81,22.2 0 bottom
C3  32.53,20.7 0 top
C4  33.13,25.52 180 top
C6  65.7,37.81 90 top
C7  53.55,28.35 180 top
C8  49.03,28.35 180 top
C9  44.75,32.6 0 top
C10  65.7,45.15 270 top
C11  32.66,17.48 0 top
C12  36.17,45.2 270 top
C13  28.93,30.47 0 top
C14  20.93,43.17 90 top
C18  76.27,6.55 270 bottom
C19  78.69,27.22 0 bottom
C20  78.69,31.03 180 bottom
C21  73.29,27.22 180 bottom
C22  62.27,16.74 270 bottom
C23  68.78,32.38 90 bottom
CHRG1  33.88,36.44 180 top
COMM_CAN_TRANSCEIVER1  19.79,13.31 270 bottom
D2  60.75,44.83 90 top
IC2  25.88,35.17 0 top
IC5  75.99,20.55 270 bottom
IC6  81.32,12.25 0 bottom
IC7  66.62,23.09 90 bottom
JP2  42.9,77.1 0 top
L2  49.29,42.09 270 top
L2-7,5NH1  80.68,10.25 90 bottom
L4-27NH1  78.69,29.12 180 bottom
LED3  20.46,25.48 0 bottom
LED4  20.66,19.33 0 bottom
P2  15.41,5.74 180 bottom
R1  10.8,46.1 90 top
R2  6.1,20.2 0 bottom
R3  28.26,25.11 270 top
R4  24.58,25.11 270 top
R5  65.7,30.47 90 top
R6  44.5,28.35 0 top
R7  53.8,32.6 0 top
R8  49.28,32.6 0 top
R11  52.81,26.01 0 bottom
R12  75.73,12.01 180 bottom
R13  66.62,16.74 270 bottom
R14  19.79,36.31 90 top
R15  33.88,31.87 90 top
R16  36.93,31.87 90 top
R17  23.85,30.47 0 top
R18  19.79,31.36 270 top
R19  36.17,40.88 270 top
R20  25.76,45.46 0 top
R21  73.92,31.31 90 bottom
R22  58.46,16.11 180 bottom
R23  16.68,25.38 90 bottom
R24  16.88,19.13 90 bottom
RX1  19.37,25.11 180 top
S2  57.23,23.47 270 bottom
STD1  36.93,36.44 180 top
T2  31.09,43.04 0 top
TX1  17.46,25.11 180 top
U2  60.47,34.51 270 top
U3  23.18,16.35 0 top
U4  32.8,14 270 top
U5  40.1,24.7 270 top
U6  36.77,22.2 0 bottom
U$2  26.14,42.03 90 top
U$3  64.01,27.82 90 bottom
X1  9.25,21.12 0 top
X2  9.2,36.6 0 top
X4  70.72,5.15 270 bottom

### Tracks (layer width: path | path; a pad name or v marks a point on that pad's centre or on a via)
3V3_DIODO
  Top 0.254: U3.17 26.11,20.91 26.6,21.4 28.2,21.4 28.9,20.7 28.9,17.5 | 28.9,17.5 31.68,17.5 C11.1 31.85,17.33 U4.3 31.85,14.45 32.1,14.2 33.2,14.2 33.75,14.75 U4.1 | 28.9,17.5 26.3,14.9 22.3,14.9 20.91,13.51 U3.4
5V  (via drill 0.35, 0.6)
  Top 0.152: 33.6,37.2 CHRG1.A | 24.8,30.7 R17.2
  Top 0.254: IC2.8 v30.9,37.07 33.47,37.07 33.6,37.2 | CHRG1.A STD1.A
  Top 0.61: R17.2 C13.1 | IC2.4 v24.4,32 24.8,31.6 24.8,30.7 | v15.3,34.6 14.6,35.3 14.6,37.3 13.7,38.2 X2.VBUS
  Bottom 0.406: 21.9,34.5 21.93,34.5 24.5,37.07 v30.9,37.07
  Bottom 0.61: v15.3,34.6 21.8,34.6 21.9,34.5 v24.4,32
5V_COM
  Top 0.152: R4.2 24.58,21.82
  Top 0.305: X1.VBUS 13.57,22.72 16.84,19.45 16.84,22.69 16.07,23.46 16.07,26.89 17.18,28.01 28.92,28.01 29.91,27.02 29.91,24.86 | 16.86,19.43 18.55,17.75 23.31,17.75 24.16,18.59 U3.20 24.16,21.39 24.58,21.82 24.96,22.19 28.69,22.19 30.18,20.7 C3.1 | 29.91,24.86 | 29.91,24.86 29.21,24.16 R3.2 R4.2 | C4.+ 30.87,24.86 29.91,24.86
+3V3  (via drill 0.35)
  Top 0.406: 3V3.A 6.65,45.05 5.3,46.4 5.3,66.6 11.6,72.9 29.2,72.9 31.4,75.1 31.4,75.76 | v26.46,14 30.75,14 arc-45 32.55,13.25 33.1,12.7 arc45 33.26,12.63 U4.5 | v16.4,8.2 17.86,9.66 arc-45 v18.2,9.8 | v43.1,26.2 43.1,24.4 43.6,23.9
  Top 0.508: 31.4,75.3 33.6,73.1 33.6,54.9 36.6,51.9 66.7,51.9 71.1,47.5 71.1,27.2 67.7,23.8 45.8,23.8 34.63,12.63 U4.5
  Top 1.016: 31.4,75.76 JP2.11
  Top 1.27: 31.4,75.3 31.4,54.1 35.6,49.9 66.2,49.9 69.2,46.9 69.2,27.5 67.2,25.5 57.31,25.5 | JP2.11 JP2.12 | 57.31,25.5 45.2,25.5 43.6,23.9 43.03,23.34 U5.5 40.9,23.18 | v59.12,27.3 57.31,25.5
  Bottom 0.152: R13.2 63.83,18.14 | 63.83,18.14 C22.1 | IC7.4 63.83,22.49 63.83,18.14
  Bottom 0.406: U6.2 45.02,25.94 | v26.46,14 22.7,12.8 arc45 COMM_CAN_TRANSCEIVER1.3 22.13,12.68 arc45 20.33,11.93 v18.2,9.8 | P2.3 16.04,7.32 arc-45 v16.4,8.2 | U6.2 50.95,26.19 arc-45 R11.2 | U6.2 v43.11,26.19 v43.1,26.2
  Bottom 1.27: C22.1 62.27,24.14 v59.12,27.3
ANT_OFF
  Bottom 0.254: R12.2 77.2,12.01 | 77.2,12.01 80.82,12.01 arc45 IC6.6 | IC5.13 77.09,16.36 arc45 76.35,18.15 76.2,18.3 arc45 74.51,19 72.3,19 arc45 70.76,18.36 70.2,17.8 arc45 69.7,16.59 69.7,12.45 arc45 70.44,10.66 71.1,10 arc45 72.31,9.5 75.3,9.5 arc45 76.5,9.99 76.8,10.3 arc45 77.2,11.27 77.2,12.01
ANT_VCC
  Bottom 0.254: IC5.14 75.99,16.01 arc45 76.7,14.3 arc45 76.94,14.2 78,14.2 79.15,14.2 arc-45 80.94,13.46 81.1,13.3 arc-45 81.32,12.77 IC6.2
BAT+  (via drill 0.35, 0.6, 0.65, 0.75)
  Top 0.508: R20.1 21.17,45.46 C14.+ | C14.+ 22.33,43.82 22.33,43.04 23.34,42.03 U$2.5 | C14.+ 19.55,46.6 v19.28,46.6 | v38.35,43.55 38.35,45.24 37.44,46.15 C12.1 | U2.2 61.1,39.76 v61.2,39.85
  Top 0.61: IC2.5 30.04,33.26 30.3,33 30.3,32.4 29.9,32 27.4,32 v27.1,32.3
  Top 1.016: C6.1 v65.7,34.1 R5.2 | v19.28,46.6 20.42,45.46 21.17,45.46
  Bottom 0.508: 17.12,42.5 17.12,42.28
  Bottom 0.61: 26.7,41.01 29.8,37.91 31.25,37.91 31.73,37.42 31.73,36.63 31.01,35.9 27.2,35.9 26.2,34.9 26.2,33.2 v27.1,32.3
  Bottom 1.016: v19.28,46.6 18.01,46.6 17.12,45.71 17.12,42.5 | 17.12,42.28 18.39,41.01 26.7,41.01 37.46,41.01 38.35,41.9 v38.35,43.55 38.35,47.45 41,50.1 59.1,50.1 61.2,48 v61.2,39.85 61.2,37.1 64.2,34.1 v65.7,34.1
CAN_H  (via drill 0.35)
  Top 0.152: v15.3,13.9 v8.9,13.9
  Bottom 0.152: COMM_CAN_TRANSCEIVER1.7 17.14,13.9 v15.3,13.9 15.2,13.9 | v8.9,13.9 7.05,15.75 R2.1 7.05,73.65 14.23,80.83 35.89,80.83 36.55,80.17 JP2.16
CAN_L  (via drill 0.35)
  Top 0.152: v15.3,12.7 v9,12.7
  Bottom 0.152: COMM_CAN_TRANSCEIVER1.6 15.32,12.68 v15.3,12.7 | v9,12.7 6.9,12.7 5,14.6 5,20.05 R2.2 5.15,75.25 11.73,81.83 38.17,81.83 39.09,80.91 JP2.18
CAN_LBK
  Bottom 0.152: COMM_CAN_TRANSCEIVER1.5 17.19,9.64 arc45 17.39,9.16 17.43,9.12 arc45 19.89,8.1 31.05,8.1
  Bottom 0.406: 31.05,8.1 U6.24
CAN_RX
  Bottom 0.152: COMM_CAN_TRANSCEIVER1.4 26.77,11.4 27.59,12.22
  Bottom 0.406: 27.59,12.22 U6.26
CAN_TX
  Bottom 0.152: COMM_CAN_TRANSCEIVER1.1 26.77,15.21 27.59,16.03
  Bottom 0.406: 27.59,16.03 U6.29
EN
  Bottom 0.152: C2.1 54.21,14.96 arc-45 53.33,12.82 48.34,7.84 arc-45 47.28,7.4 21.25,7.4 arc45 19.45,6.66 P2.1
  Bottom 0.406: U6.3 45.45,24.74 51.67,24.74 C2.1 54.23,22.22 R11.1 54.84,26.62 S2.1
EXT_INTERRUPT_TESEO  (via drill 0.35)
  Top 0.254: v76.1,23 80.4,27.3 80.4,72.8 74.9,78.3 67.1,78.3 JP2.40
  Bottom 0.254: IC5.5 76.1,24.94 v76.1,23
GND  (via drill 0.35)
  Top 0.152: 23.1,11.1 22.86,11.35 U3.7 22.86,13.7 | 40.7,26.78 41.4,26.78 41.53,26.65 41.53,24.99 40.74,24.2 40.69,24.2 40.04,23.54 40.04,22.66 41,21.7 | 41,21.86 41,21.7 | 41,21.7 41,21.6 | T2.6 T2.7 30.77,45.63 31.4,45 | R19.1 36.17,41.66 35.19,40.68 35.19,39.19 35.33,39.05 36.89,39.05 37.76,38.18 37.76,36.79 37.35,36.38 27.89,36.38 27.75,36.25 27.75,34.09 27.89,33.95 30.1,33.95 30.83,33.22 30.83,31.42 30.05,30.64 | C13.2 30.05,30.64 | C12.2 32.63,47.8 31.57,47.8 30.87,48.5 29.1,48.5 | v73.8,47.1 73.8,49.15 68.5,54.46 60.79,54.46 50.44,64.8 50.44,76.44 49.66,77.22 46.5,77.22 45.42,76.14 45.42,75.08 44.88,74.54 33.4,74.54 32.86,75.08 32.86,79.28 32.28,79.86 30.76,79.86 30.18,79.28 30.18,75.28 28.73,73.83 8.62,73.83 4.27,69.48 4.27,43.93 5.1,43.1 13.8,43.1 14.3,43.6 14.3,47.6 12.7,49.2 8.67,49.2 6.67,51.2 6.67,64.64 14.04,72.01 27.15,72.01 28.19,70.97 28.19,53.08 32.77,48.49 45.15,48.49 46.95,46.69 47.45,46.69 47.74,46.98 66.55,46.98 67.93,45.59 67.93,40.4 | v78.8,13 78.3,13.5 78.3,16 77,16 v74.9,13.9 | 56.1,14.8 57.4,16.1 | v71.7,12.4 68.5,12.4 68.2,12.7 | 30.05,30.64 29.23,31.47 26.36,31.47 23.3,34.53 IC2.3 | v15.6,16.4 14,14.8 v11.5,14.8 | 67.93,40.4 67.93,28.4 66.45,26.92 60.9,26.92 59.65,28.16 56.03,28.16 55.24,27.37 53.75,27.37 53.62,27.5 53.62,29.2 53.75,29.33 59.85,29.33 61.15,28.04 65.94,28.04 66.68,28.77 66.68,37.78 C6.2 | 67.93,40.4 66.9,41.43 65.9,41.43 v65.6,41.73 | U4.2 32.8,16.67 C11.2 | U5.2 40.57,26.53 40.57,26.65 40.7,26.78 | 40.7,26.78 42.27,28.35 R6.1 43.55,30.15 44.1,30.7 v50.2,30.7 | U3.21 23.26,19.76 23.26,19.21 23.05,19 22.5,19
  Top 0.152: 22.5,19 21.3,19 20.91,19.39 U3.25 U3.26 | U3.18 25.21,19.76 25.21,19.21 24.84,18.84 v24.84,18.6 | v22.5,18.5 22.5,19 | 22.86,13.7 22.86,13.96 22.9,14 | v24.2,14.1 23.8,13.7 22.86,13.7 | C3.2 33.48,22.02 32.7,22.8 v31.4,22.8
  Bottom 0.152: IC6.1 78.81,12.45 78.8,12.46 v78.8,13 78.8,13.2 78.81,13.19 | IC5.12 78.19,17.19 78.3,17.3 | IC7.2 66.62,26.32 66.8,26.5 | IC6.4 81.87,11.9 81.87,9.73 82.5,9.1 82.5,9.2 82.4,9.3 82.21,9.3 81.87,9.64 | v74.9,13.9 74.33,13.33 R12.1 72.09,12.01 v71.7,12.4 | C2.2 v51.41,14.81 v51.4,14.8 | C19.2 78.71,28.64 78.71,29.54 80.09,30.92 C20.2 | 19.58,15.01 R24.1 | COMM_CAN_TRANSCEIVER1.2 21.31,13.95 | R24.1 15.5,19.09 15.5,22.78 R23.1 | R24.1 15.6,16.43 v15.6,16.4 | v65.6,41.73 65.6,41.3 65.5,41.3 65.5,41.6 | C22.2 62.27,16.11 60.59,17.8 57.35,17.8 57.06,17.5 R22.1 | 23.47,19 23.57,19.1 23.9,19.1 24.4,18.6 v24.84,18.6 22.6,18.6 v22.5,18.5 | v50.2,30.7 46.96,27.46 U6.1 | COMM_CAN_TRANSCEIVER1.2 20.45,13.95 v19.9,14.5 | COMM_CAN_TRANSCEIVER1.2 22.55,14.1 v24.2,14.1 | v31.4,22.8 31.4,26.2 30.1,27.5 28.31,27.5 U6.38
  pour Top (isolate 0.61): 0,82.7 arc-90 3.4,86.1 arc90 3.5,86 23.6,86 arc-90 24.9,84.7 24.9,84.3 arc90 26.2,83 59.6,83 arc90 61.1,84.5 61.1,84.7 arc-90 62.5,86.1 62.9,86.1 arc90 63,86 83.3,86 arc-90 86,83.3 86,72.5 arc-90 84.7,71.2 84.5,71.2 arc90 82.9,69.6 82.9,16.5 arc90 84.4,15 84.6,15 arc-90 86,13.6 86,2.9 arc-90 83.2,0.1 82.9,0.1 arc-90 82.8,0 64,0 arc-90 60.9,3.1 60.9,3.5 arc90 58.4,6 28.1,6 arc90 25,2.9 25,2.8 arc-90 22.2,0 2.4,0 arc-90 0,2.4 0,13.8 arc-90 1.2,15 1.7,15 arc90 3,16.3 3,51.5 arc-90 2.9,51.6 2.9,69.7 arc90 1.5,71.1 1.2,71.1 arc-90 0,72.3
  pour Bottom (isolate 0.61): 2.9,86 23.6,86 arc-90 25,84.6 25,84.4 arc90 26.4,83 59.6,83 arc90 61,84.4 61,84.5 arc-90 62.5,86 83.1,86 arc-90 86,83.1 86,72.4 arc-90 84.6,71 84.5,71 arc90 83,69.5 83,16.6 arc90 84.6,15 arc-90 86,13.6 86,3 arc-90 83,0 64,0 arc-90 61,3 arc90 58,6 28,6 arc90 25,3 25,2.9 arc-90 22.1,0 3,0 arc-90 0,3 0,13.6 arc-90 1.4,15 1.5,15 arc90 3,16.5 3,51.8 arc-90 2.9,51.9 2.9,69.7 arc90 1.5,71.1 1,71.1 arc-90 0,72.1 0,74.4 arc-90 -0.1,74.5 -0.1,83 arc-90
GNSS_SIG
  Bottom 0.254: IC5.11 79.29,15.64 arc45 79.56,14.99 arc45 80.5,14.6 arc-45 81.35,14.25 81.6,14 arc-45 81.72,13.71 IC6.3
INT
  Bottom 0.152: C20.1 77.29,30.41 78.27,29.44 L4-27NH1.1 | C20.1 68.82,31.03 C23.1 68.76,31 U$3.2 | R21.2 75.61,32.71 C20.1
IO0  (via drill 0.35)
  Top 0.152: v18.5,7.7 arc-45 v19,8.89 v19,8.9
  Bottom 0.152: 27.84,10.95 U6.25 arc-45 27.67,10.7 22.84,10.7 arc45 19.36,9.26 v19,8.9 | P2.2 arc-45 17.81,7.01 v18.5,7.7
MISO_BUS
  Bottom 0.152: U6.22 33.59,27.7 32.8,28.5 26,28.5 25.4,29.1 25.4,30.1 24.3,31.2 13.2,31.2 10.3,34.1 10.3,59 9.1,60.2 9.1,64.8 13.4,69.1 27.28,69.1 JP2.13
MOSI_BUS  (via drill 0.35)
  Top 0.152: v45.6,45.6 43.1,48.1 31.7,48.1 26.9,52.9 v26.9,71.4 26.9,71.5
  Bottom 0.152: U6.21 34.87,27.16 36.27,28.57 46.14,28.57 46.83,29.27 46.83,44.37 v45.6,45.6 | v26.9,71.4 30.2,74.7 30.2,76.6 30.7,77.1 32.74,77.1 JP2.14
N$8
  Top 0.508: R5.1 64.7,28.52 61.88,28.52 61.1,29.3 U2.7
N$9
  Top 0.508: R6.2 C8.2
N$10
  Top 0.508: C7.1 54.9,28.75 59.75,28.75 61.1,27.4 66.25,27.4 67.45,28.6 67.45,40.2 66.7,40.95 64.85,40.95 63.95,40.05 63.95,33.61 U2.8
N$11
  Top 0.508: U2.6 59.84,30.42 59.32,29.9 51.53,29.9 C8.1
N$12
  Top 0.508: C10.1 65.6,46 64.95,46 61.78,42.83 D2.C | D2.C 60.65,42.93 | D2.C 60.75,42.4 59.84,41.48 U2.3 | D2.C 57.33,42.83 55.95,41.45 L2.1
N$13
  Top 0.508: R8.2 R7.1 52.84,31.55 53.6,30.8 57.83,30.8 58.56,31.54 U2.5 58.56,32.73
N$14
  Top 0.508: U2.1 62.38,41.02 65.55,44.2 C10.2
N$19
  Top 0.203: TX1.A 18.7,27.4 26.92,27.4 R3.1
N$20
  Top 0.203: RX1.A 19.72,26.51 24.13,26.51 R4.1
N$21
  Top 0.305: 3V3.C 10.7,47.15 R1.2
N$22
  Bottom 0.406: 20.19,26.8 LED3.C 17.34,26.53 arc-45 R23.2
N$23
  Bottom 0.406: LED4.C 20.49,20.55 R24.2
N$24
  Bottom 0.406: LED4.A 20.9,18.04 arc45 22.69,17.3 U6.30
N$25
  Bottom 0.406: LED3.A 25.79,19.1 arc45 27.07,18.57 U6.31
N$28
  Bottom 0.152: L4-27NH1.2 79.11,28.96 80.09,27.99 C19.1 80.09,26.42 79.29,25.62 IC5.8 IC5.7 IC5.6
N$29
  Bottom 0.254: X4.ANTENNA C18.2
N$30
  Bottom 0.254: IC6.5 L2-7,5NH1.1
N$31
  Top 0.61: IC2.2 21.95,35.8 20.49,37.26 R14.2
N$32
  Top 0.508: IC2.7 31.09,35.8 32.36,34.53 32.36,31.49 32.93,30.92 R15.1
N$33
  Top 0.508: IC2.6 30.58,34.53 31.47,33.65 31.47,30.85 32.74,29.58 36.3,29.58 37.06,30.34 37.06,30.79 R16.1
N$35
  Top 0.61: CHRG1.C R15.2
N$36
  Top 0.61: STD1.C R16.2
N$37
  Top 0.508: R17.1 22.84,30.41 R18.2 18.32,30.41 17.75,30.98 17.75,38.47 18.26,38.98 21.44,38.98 23.13,37.28 IC2.1
N$38
  Top 0.406: U$2.2 26.52,42.03 26.26,42.28 26.26,43.68 26.52,43.93 27.79,43.93 28.55,44.69 28.55,47.11 27.79,47.87 18.9,47.87 16.74,45.71 16.74,30.09 18.14,28.69 37.31,28.69 38.84,30.22 38.84,39.11 38.01,39.93 R19.2
N$39  (via drill 0.75)
  Top 0.508: R20.2 26.71,46.34 26.02,47.03 23.27,47.03 v22.89,46.65
  Bottom 1.016: v22.89,46.65 22.89,49.45 19.39,52.95 13.69,52.95 11.65,54.99 BT2.PWR@1
N$40  (via drill 0.75)
  Top 0.305: T2.2 31.09,40.12 T2.3
  Top 0.406: 25.12,39.61 26.57,38.16 28.88,38.16 28.88,38.17 32.08,38.17 32.74,38.82 32.74,41.01 32.36,41.39 31.09,41.39 31.09,40.63 31.09,40.12
  Top 0.508: U$2.6 24.74,41.08 | 24.74,41.08 20.97,41.08 C14.- | 24.74,41.08 24.74,39.99 25.12,39.61 | 31.09,40.63 31.09,42.03 32.61,43.55 v33.25,43.55
  Bottom 1.016: BT2.GND@1 72.91,55.81 69.8,52.7 35.9,52.7 33.25,50.05 33.25,46.8 | v33.25,43.55 33.25,46.8 | 33.25,46.8
N$41
  Top 0.406: T2.8 T2.1
N$42
  Top 0.406: U$2.1 27.8,41.08 28.42,40.45 28.42,39.49 29.06,38.85 31.34,38.85 32.06,39.57 T2.4
N$43
  Top 0.406: U$2.3 28.36,42.98 29.31,43.93 29.31,46.6 30.07,47.36 31.73,47.36 32.06,47.02 T2.5
N$44
  Bottom 0.254: C18.1 77.83,9.51 arc-45 79.62,10.25 L2-7,5NH1.2
N$45
  Bottom 0.152: IC7.1 67.58,19.09 R13.1
N$46
  Bottom 0.152: 65.66,21.82 IC7.3 65.99,22.16 65.99,23.46 66.2,23.67 66.2,25.42 64.01,27.61 U$3.1
N$47
  Bottom 0.152: R21.1 71.12,29.91 67.58,26.36 IC7.5 69.17,22.75 69.17,13.56 68.33,12.73 60.69,12.73 59.86,13.55 R22.2
OUT
  Top 0.305: U5.3 39.15,25.15 39.5,24.8 40.8,24.8 41.05,25.05 U5.1
  Top 0.508: R7.2 54.74,33.8 47.09,41.45 L2.2 43.7,40.87 43.7,32.7 C9.1
  Top 0.813: U5.3 38.7,26.52 38.7,27.68 40.7,29.68 40.7,39.78 42.37,41.45 L2.2
PPS_TESEO  (via drill 0.35)
  Top 0.254: v74.9,23 79.4,27.5 79.4,72.3 77.9,73.8 68.4,73.8 67.03,75.17 JP2.39
  Bottom 0.152: C21.2 74.89,27.02 IC5.4
  Bottom 0.254: IC5.4 v74.89,23.01 v74.9,23
RESET_TESEO  (via drill 0.35)
  Top 0.254: v80.4,23 81.3,23.9 81.3,74.1 75,80.4 66.4,80.4 64.49,78.49 JP2.38
  Bottom 0.254: IC5.9 v80.39,23.01 v80.4,23
RXLED
  Top 0.203: RX1.C 19.37,23.34 20,22.7 21.66,22.7 22.86,21.5 U3.22
SCL_BUS  (via drill 0.35)
  Top 0.254: v73.9,18 73.9,23.3 78.3,27.7 78.3,71.6 78.4,71.7 77.4,72.7 v51.1,72.7
  Bottom 0.254: IC5.17 72.69,16.79 v73.9,18 | v51.1,72.7 41.9,72.7 40.9,73.7 40.9,75.1 JP2.19
SCLK_BUS  (via drill 0.35)
  Top 0.152: v47.2,47.3 47.2,48 46.4,48.8 32.9,48.8 28.8,52.9 v28.8,66.2
  Bottom 0.152: U6.20 36.13,11.94 41.9,17.7 41.9,26.9 43.2,28.2 46.2,28.2 47.2,29.2 v47.2,47.3 | v28.8,66.2 28.8,66.8 36.55,74.55 JP2.15
SDA_BUS  (via drill 0.35)
  Top 0.254: 51.2,71.4 v51.1,71.5 76.3,71.5 77.3,70.5 77.3,28.4 72.7,23.8 v72.7,14.3
  Bottom 0.254: IC5.16 73.79,15.39 v72.7,14.3 | v51.1,71.5 41.4,71.5 39.7,73.2 39.7,75.22 JP2.17
TXLED
  Top 0.203: TX1.C 17.46,23.3 18.57,22.19 21.53,22.19 22.2,21.52 U3.23
UART_RX  (1 unrouted)
  Bottom 0.152: U6.34 25.96,22.38 23.6,24.74 23.6,29.82 23.23,30.19 15.59,30.19 14.59,29.18 14.59,5.77
UART_RX_BUS  (via drill 0.35)
  Top 0.152: v21.9,9.1 21.3,8.5
  Top 0.254: U3.1 18.95,10.14 20.6,8.5 21.3,8.5 33.65,8.5 47.15,22 68.25,22 72.9,26.65 72.9,48.35 67.35,53.9 56.9,53.9 48.3,62.5 48.3,74.88 JP2.25
  Bottom 0.152: U6.27 29.51,13.49 29.8,13.2 29.8,10.2 28.7,9.1 v21.9,9.1
UART_TX  (1 unrouted)
  Bottom 0.152: 27.23,23.65 24.87,26.01 24.87,29.39 23.5,30.76 14.86,30.76 13.4,29.3 13.4,6.31 13.74,5.97 13.74,5.71 13.65,5.62
  Bottom 0.406: U6.35 27.23,23.65
UART_TX_BUS  (via drill 0.35)
  Top 0.152: v30.5,11.5 30.5,9.7 29.9,9.1
  Top 0.254: U3.5 21.55,10.45 22.9,9.1 29.9,9.1 33.4,9.1 46.9,22.6 68,22.6 72.3,26.9 72.3,48.1 67.1,53.3 56.65,53.3 47.7,62.25 47.7,74.84 JP2.23
  Bottom 0.152: U6.28 30.14,14.76 30.6,14.3 30.6,11.6 v30.5,11.5
USB_D+1
  Top 0.203: X1.D+ 13.25,21.12 17.86,16.5 25.36,16.5 27.41,18.54 U3.15
USB_D-1
  Top 0.203: X1.D- 13.4,21.92 18.21,17.11 24.79,17.11 26.75,19.08 U3.16

### Text on the board
bNames: Charger | Serial